# Altium schematic sheet TX0.SchDoc
size 431 x 279 mm; Organization: ORGANIZATION; Address1: ADDRESS 1; Address2: ADDRESS 2; Address3: ADDRESS 3; Address4: ADDRESS 4; Revision: -; SheetNumber: 2; SheetTotal: 8; ENG_APP_DATE: --/--/--; DSN_APP_DATE: --/--/--; CHK_APP_DATE: --/--/--
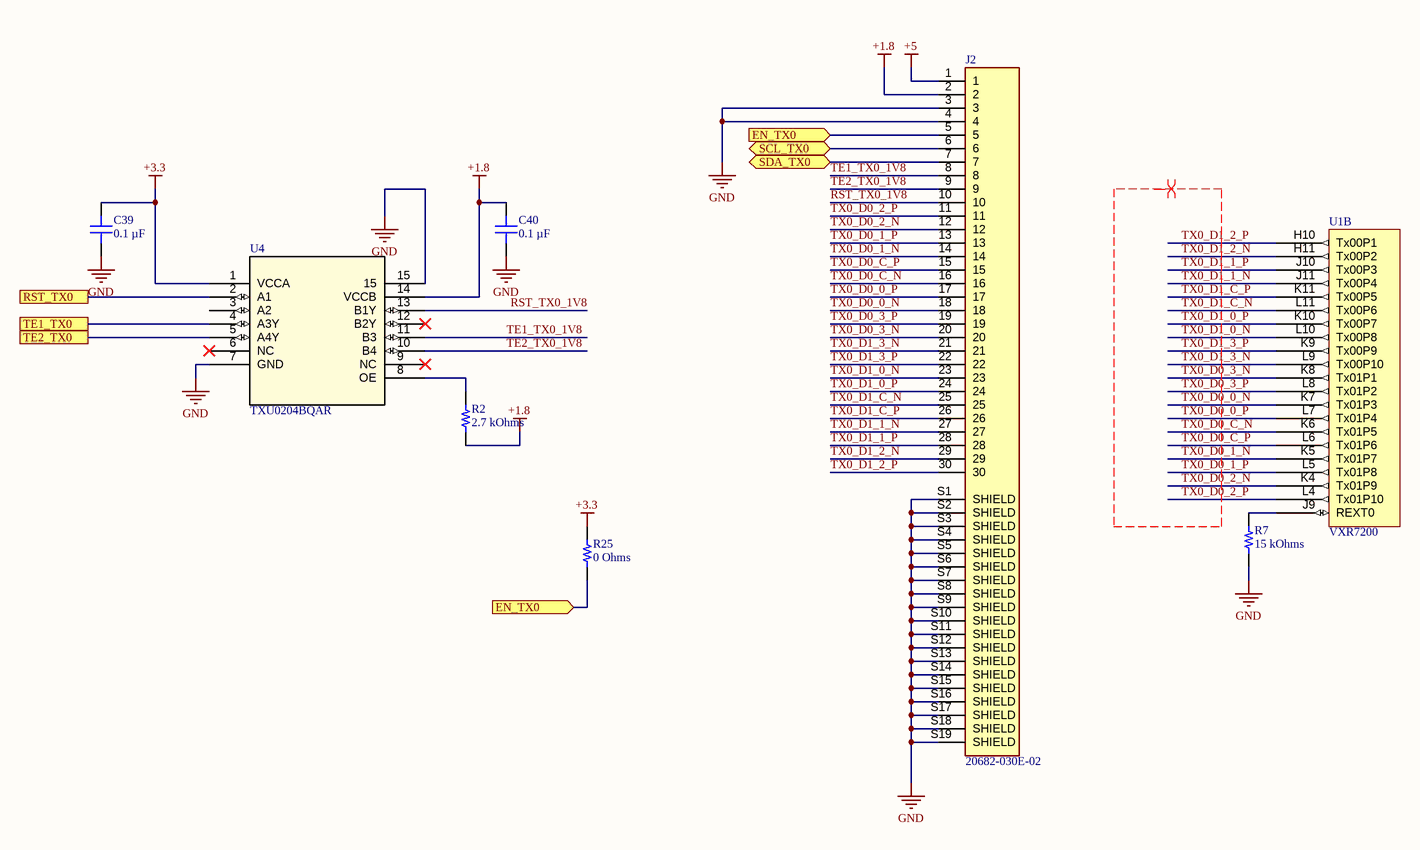
[diagram p0: TX0.SchDoc]

## Parts
C39  0.1 µF  [CAP 0201_0603]
C40  0.1 µF  [CAP 0201_0603]
J2  20682-030E-02  [IPEX_20682-030E-02]
R2  2.7 kOhms  [RES 0201_0603]
R7  15 kOhms  [RES 0201_0603]
R25  0 Ohms  [RES 0402_1005]
U1  VXR7200  [BGA100P9X9-81A]  (part B of 9)
U4  TXU0204BQAR  [WQFN_04BQAR_TEX]

## Ports
EN_TX0 (in), RST_TX0, SCL_TX0 (bidir), SDA_TX0 (bidir), TE1_TX0, TE2_TX0

## Nets
+1.8: C40.2 J2.2 R2.1 U4.14(VCCB)
+3.3: C39.2 R25.2 U4.1(VCCA)
+5: J2.1
GND: C39.1 C40.1 J2.3 J2.4 J2.S1(SHIELD) J2.S2(SHIELD) J2.S3(SHIELD) J2.S4(SHIELD) J2.S5(SHIELD) J2.S6(SHIELD) J2.S7(SHIELD) J2.S8(SHIELD) J2.S9(SHIELD) J2.S10(SHIELD) J2.S11(SHIELD) J2.S12(SHIELD) J2.S13(SHIELD) J2.S14(SHIELD) J2.S15(SHIELD) J2.S16(SHIELD) J2.S17(SHIELD) J2.S18(SHIELD) J2.S19(SHIELD) R7.1 U4.7(GND) U4.15
EN_TX0: J2.5 R25.1 ; port EN_TX0
RST_TX0: U4.2(A1) ; port RST_TX0
RST_TX0_1V8: J2.10 U4.13(B1Y)
SCL_TX0: J2.6 ; port SCL_TX0
SDA_TX0: J2.7 ; port SDA_TX0
TE1_TX0: U4.4(A3Y) ; port TE1_TX0
TE1_TX0_1V8: J2.8 U4.11(B3)
TE2_TX0: U4.5(A4Y) ; port TE2_TX0
TE2_TX0_1V8: J2.9 U4.10(B4)
TX0_D0_0_N: J2.18 U1.K7(Tx01P3)
TX0_D0_0_P: J2.17 U1.L7(Tx01P4)
TX0_D0_1_N: J2.14 U1.K5(Tx01P7)
TX0_D0_1_P: J2.13 U1.L5(Tx01P8)
TX0_D0_2_N: J2.12 U1.K4(Tx01P9)
TX0_D0_2_P: J2.11 U1.L4(Tx01P10)
TX0_D0_3_N: J2.20 U1.K8(Tx01P1)
TX0_D0_3_P: J2.19 U1.L8(Tx01P2)
TX0_D0_C_N: J2.16 U1.K6(Tx01P5)
TX0_D0_C_P: J2.15 U1.L6(Tx01P6)
TX0_D1_0_N: J2.23 U1.L10(Tx00P8)
TX0_D1_0_P: J2.24 U1.K10(Tx00P7)
TX0_D1_1_N: J2.27 U1.J11(Tx00P4)
TX0_D1_1_P: J2.28 U1.J10(Tx00P3)
TX0_D1_2_N: J2.29 U1.H11(Tx00P2)
TX0_D1_2_P: J2.30 U1.H10(Tx00P1)
TX0_D1_3_N: J2.21 U1.L9(Tx00P10)
TX0_D1_3_P: J2.22 U1.K9(Tx00P9)
TX0_D1_C_N: J2.25 U1.L11(Tx00P6)
TX0_D1_C_P: J2.26 U1.K11(Tx00P5)
NetR2_2: R2.2 U4.8(OE)
NetR7_2: R7.2 U1.J9(REXT0)

Not connected (* = marked no-connect by the designer): U4 3(A2) 6(NC)* 9(NC)* 12(B2Y)*

## Layout directives
differential pair; net class MIPI; differential pair class MIPI: TX0_D0_0_N, TX0_D0_0_P, TX0_D0_1_N, TX0_D0_1_P, TX0_D0_2_N, TX0_D0_2_P, TX0_D0_3_N, TX0_D0_3_P, TX0_D0_C_N, TX0_D0_C_P, TX0_D1_0_N, TX0_D1_0_P, TX0_D1_1_N, TX0_D1_1_P, TX0_D1_2_N, TX0_D1_2_P, TX0_D1_3_N, TX0_D1_3_P, TX0_D1_C_N, TX0_D1_C_P

## Notes on the sheet
- DWG. NO.
- REV.
- SHT.
- REVISION
- DESCRIPTION
- DATE
- APPROVED
- ENG:
- APPROVALS
- PROJECT
- DSN:
- CHK:
- REFERENCE DOCUMENTS
- PROJECT REVISION:
- TITLE
- SimulaVR
- DOCUMENT REVISION:
- DESIGN ITEM:
- BOM:
- FAB DWG:
- PCB DWG:
- ASSY DWG:
- SCALE:
- SIZE
- B
- CAGE CODE
- FILE NAME
- DWG NO.
- SHEET
- OF
- REV

## Library data of the parts
C39 C40 = GRM033R61E104KE14D: CAP CER 0.1UF 25V X5R 0201; manufacturer: Murata Electronics; Tolerance: ±10%; Part Number: GRM033R61E104KE14D; Value: 0.1 µF; Applications: General Purpose; Capacitance: 0.1 µF; componentlink1description: Datasheet; componentlink1url: https://search.murata.co.jp/Ceramy/image/img/A01X/G101/ENG/GRM033R61E104KE14-01.pdf; componentlink2description: DigiKey Link; componentlink2url: https://www.digikey.com/en/products/detail/murata-electronics/GRM033R61E104KE14D/4904731; Device Package: 0201 (0603 Metric); lastupdated: 5/20/2022 2:33:00 PM; Lifecycle Status: Active; Minimum Order: 1; Mounting Type: Surface Mount; Operating Temperature: -55°C ~ 85°C; Package / Case: 0201 (0603 Metric); packaging: TapeAndReel; partid: 39731; Part Status: Active; price: 0.01; series: GRM; Size / Dimension: 0.024" L x 0.012" W (0.60mm x 0.30mm); Supplier 1: DigiKey; Supplier Part Number 1: 490-12686-1-ND; Temperature Coefficient: X5R; Thickness (Max): 0.013" (0.33mm); Voltage - Rated: 25V
J2 = 20682-030E-02: Cabline-CAII Rece. Ass'y; MF: {'manufacturer': u'I-PEX'}; Value: *; Availability: Unavailable; Price: None; Package: None; MP: 20682-030E-02
R2 = ERJ-U01J272C: RES 2.7K OHM 5% 1/20W 0201 SMD; Manufacturer: Panasonic Electronic Components; Power (Watts): 0.05W, 1/20W; Temperature Coefficient: ±200ppm/°C; Part Number: ERJ-U01J272C; Value: 2.7 kOhms; ComponentLink1Description: Datasheet; ComponentLink1URL: https://industrial.panasonic.com/cdbs/www-data/pdf/RDP0000/AOA0000C334.pdf; ComponentLink2Description: DigiKey Link; ComponentLink2URL: https://www.digikey.com/en/products/detail/panasonic-electronic-components/ERJ-U01J272C/11641374; Composition: Thick Film; Device Package: 0201 (0603 Metric); Features: Anti-Sulfur; Height - Seated (Max): 0.010" (0.26mm); LastUpdated: 2022-04-12 22:15:26; Lifecycle Status: Active; Minimum Order: 1; Number of Terminations: 2; Operating Temperature: -55°C ~ 125°C; Package / Case: 0201 (0603 Metric); Packaging: TapeAndReel; PartId: 64645; Part Status: Active; Price: 0.04; Resistance: 2.7 kOhms; Series: ERJ-U01; Size / Dimension: 0.024" L x 0.012" W (0.60mm x 0.30mm); Supplier 1: DigiKey; Supplier Part Number 1: 10-ERJ-U01J272CCT-ND; Supplier Device Package: 0201; Tolerance: ±5%
R7 = ERJ-1GNF1502C: RES SMD 15K OHM 1% 1/20W 0201; Manufacturer: Panasonic Electronic Components; Power (Watts): 0.05W, 1/20W; Temperature Coefficient: ±200ppm/°C; Part Number: ERJ-1GNF1502C; Value: 15 kOhms; ComponentLink1Description: Datasheet; ComponentLink1URL: https://industrial.panasonic.com/cdbs/www-data/pdf/RDA0000/AOA0000C304.pdf; ComponentLink2Description: DigiKey Link; ComponentLink2URL: https://www.digikey.com/en/products/detail/panasonic-electronic-components/ERJ-1GNF1502C/2036244; Composition: Thick Film; Device Package: 0201 (0603 Metric); Features: Automotive AEC-Q200; Height - Seated (Max): 0.010" (0.26mm); LastUpdated: 2022-05-10 16:40:15; Lifecycle Status: Active; Minimum Order: 1; Number of Terminations: 2; Operating Temperature: -55°C ~ 125°C; Package / Case: 0201 (0603 Metric); Packaging: TapeAndReel; PartId: 3474; Part Status: Active; Price: 0.01; Ratings: AEC-Q200; Resistance: 15 kOhms; Series: ERJ-1GN; Size / Dimension: 0.024" L x 0.012" W (0.60mm x 0.30mm); Supplier 1: DigiKey; Supplier Part Number 1: P122744CT-ND; Supplier Device Package: 0201; Tolerance: ±1%
R25 = AC0402FR-070RL: RESISTOR 0402 JUMPER ZERO OHM; Manufacturer: Yageo; Power (Watts): 0.063W, 1/16W; Part Number: AC0402FR-070RL; Value: 0 Ohms; ComponentLink1Description: Datasheet; ComponentLink1URL: https://www.yageo.com/upload/media/product/productsearch/datasheet/rchip/PYu-AC_51_RoHS_L_8.pdf; ComponentLink2Description: DigiKey Link; ComponentLink2URL: https://www.digikey.com/en/products/detail/yageo/AC0402FR-070RL/12082398; Composition: Thick Film; Device Package: 0402 (1005 Metric); Features: Automotive AEC-Q200, Moisture Resistant; Height - Seated (Max): 0.015" (0.37mm); LastUpdated: 2022-04-12 22:19:37; Lifecycle Status: Active; Minimum Order: 1; Number of Terminations: 2; Operating Temperature: -55°C ~ 155°C; Package / Case: 0402 (1005 Metric); Packaging: CutTape; PartId: 66976; Part Status: Active; Price: 0.01; Ratings: AEC-Q200; Resistance: 0 Ohms; Series: AC; Size / Dimension: 0.039" L x 0.020" W (1.00mm x 0.50mm); Supplier 1: DigiKey; Supplier Part Number 1: 13-AC0402FR-070RLCT-ND; Supplier Device Package: 0402; Tolerance: Jumper
U1 = CMP-015-00008-4: VXR7200 DP to MIPI-DSI bridge
U4 = CMP-006-000001-1: No Description Available; Mfr_Name: Texas Instruments; Design Item ID: TXU0204BQAR; RefDes: RefDes; Copyright: Copyright (C) 2022 Ultra Librarian. All rights reserved.; Type: DEV; Manufacturer_Part_Number: TXU0204BQAR; Source: TXU0204BQAR.SchLib